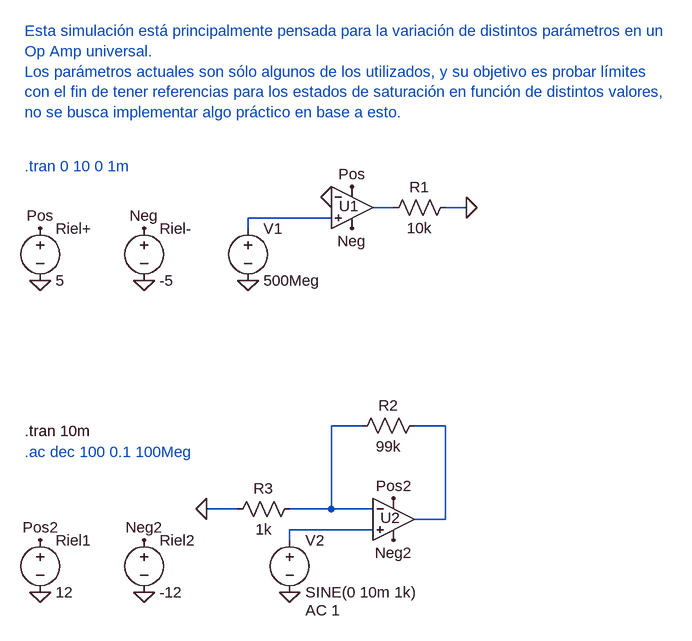
[diagram p0: schematic Sim_TestParametros.asc]
Sim_TestParametros.asc, the LTspice schematic file:
Version 4.1
SHEET 1 1868 748
WIRE 608 112 576 112
WIRE 720 112 688 112
WIRE 512 128 384 128
WIRE 384 144 384 128
WIRE 560 448 512 448
WIRE 688 448 640 448
WIRE 368 576 320 576
WIRE 512 576 512 448
WIRE 512 576 448 576
WIRE 576 576 512 576
WIRE 688 592 688 448
WIRE 688 592 640 592
WIRE 576 608 448 608
WIRE 448 624 448 608
FLAG 64 144 Pos
FLAG 224 144 Neg
FLAG 224 224 0
FLAG 64 224 0
FLAG 384 224 0
FLAG 544 144 Neg
FLAG 544 80 Pos
FLAG 720 112 0
FLAG 512 96 0
FLAG 64 624 Pos2
FLAG 224 624 Neg2
FLAG 224 704 0
FLAG 64 704 0
FLAG 448 704 0
FLAG 608 624 Neg2
FLAG 608 560 Pos2
FLAG 320 576 0
SYMBOL voltage 64 128 R0
WINDOW 123 0 0 Left 0
WINDOW 39 0 0 Left 0
SYMATTR InstName Riel+
SYMATTR Value 5
SYMBOL voltage 224 128 R0
WINDOW 123 0 0 Left 0
WINDOW 39 0 0 Left 0
SYMATTR InstName Riel-
SYMATTR Value -5
SYMBOL voltage 384 128 R0
WINDOW 123 0 0 Left 0
WINDOW 39 0 0 Left 0
SYMATTR InstName V1
SYMATTR Value 500Meg
SYMBOL OpAmps\\UniversalOpAmp2 544 112 R0
WINDOW 0 -20 -2 Left 2
SYMATTR InstName U1
SYMBOL res 704 96 R90
WINDOW 0 0 56 VBottom 2
WINDOW 3 32 56 VTop 2
SYMATTR InstName R1
SYMATTR Value 10k
SYMBOL voltage 64 608 R0
WINDOW 123 0 0 Left 0
WINDOW 39 0 0 Left 0
SYMATTR InstName Riel1
SYMATTR Value 12
SYMBOL voltage 224 608 R0
WINDOW 123 0 0 Left 0
WINDOW 39 0 0 Left 0
SYMATTR InstName Riel2
SYMATTR Value -12
SYMBOL voltage 448 608 R0
WINDOW 123 24 124 Left 2
WINDOW 39 0 0 Left 0
SYMATTR Value2 AC 1
SYMATTR InstName V2
SYMATTR Value SINE(0 10m 1k)
SYMBOL OpAmps\\UniversalOpAmp2 608 592 R0
WINDOW 0 -20 -2 Left 2
SYMATTR InstName U2
SYMBOL res 656 432 R90
WINDOW 0 0 56 VBottom 2
WINDOW 3 32 56 VTop 2
SYMATTR InstName R2
SYMATTR Value 99k
SYMBOL res 464 560 R90
WINDOW 0 0 56 VBottom 2
WINDOW 3 32 56 VTop 2
SYMATTR InstName R3
SYMATTR Value 1k
TEXT 40 48 Left 2 ;.tran 0 10 0 1m
TEXT 40 -160 Left 2 ;Esta simulación está principalmente pensada para la variación de distintos parámetros en un\nOp Amp universal.\nLos parámetros actuales son sólo algunos de los utilizados, y su objetivo es probar límites\ncon el fin de tener referencias para los estados de saturación en función de distintos valores,\nno se busca implementar algo práctico en base a esto.
TEXT 40 488 Left 2 ;.ac dec 100 0.1 100Meg
TEXT 40 456 Left 2 !.tran 10m

The netlist it stands for:
* Sim_TestParametros.asc
V§Riel+ Pos 0 5
V§Riel- Neg 0 -5
V1 N002 0 500Meg
X§U1 N002 0 Pos Neg N001 level2 Avol=1Meg GBW=10Meg Slew=10Meg Ilimit=25m Rail=0 Vos=0 En=0 Enk=0 In=0 Ink=0 Rin=500Meg  ; pins In+ In- V+ V- OUT
R1 0 N001 10k
V§Riel1 Pos2 0 12
V§Riel2 Neg2 0 -12
V2 N005 0 SINE(0 10m 1k) AC 1
X§U2 N005 N003 Pos2 Neg2 N004 level2 Avol=1Meg GBW=10Meg Slew=10Meg Ilimit=25m Rail=0 Vos=0 En=0 Enk=0 In=0 Ink=0 Rin=500Meg  ; pins In+ In- V+ V- OUT
R2 N004 N003 99k
R3 N003 0 1k
* .tran 0 10 0 1m
* Esta simulación está principalmente pensada para la variación de distintos parámetros en un
* Op Amp universal.
* Los parámetros actuales son sólo algunos de los utilizados, y su objetivo es probar límites
* con el fin de tener referencias para los estados de saturación en función de distintos valores,
* no se busca implementar algo práctico en base a esto.
* .ac dec 100 0.1 100Meg
.tran 10m
.lib UniversalOpAmp2.lib
.backanno
.end